# Altium schematic sheet schematic.SchDoc
size A4
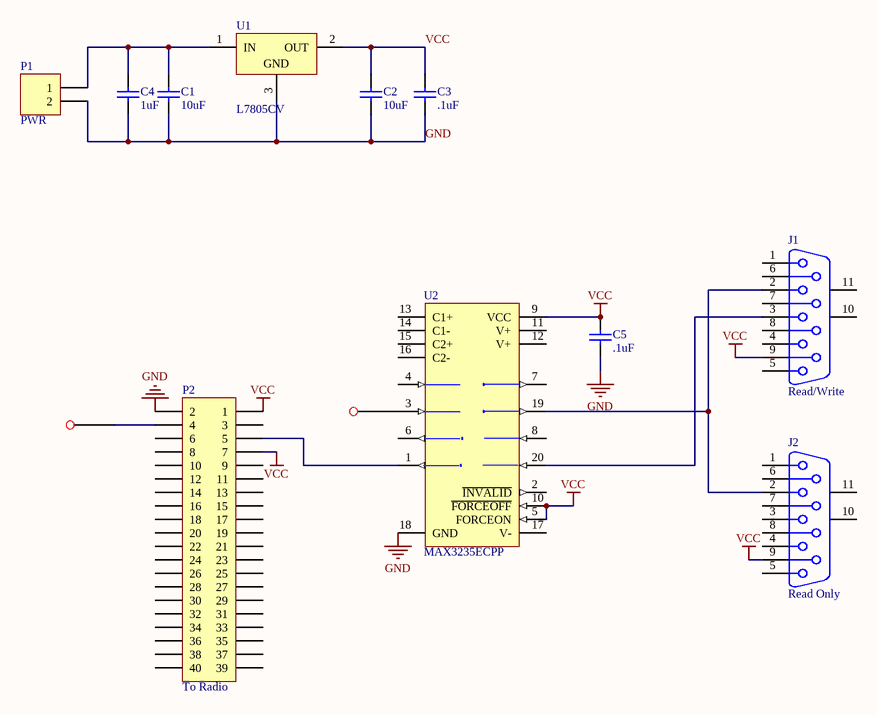
[diagram p0: schematic.SchDoc]

## Parts
C1  10uF  [1206]
C2  10uF  [1206]
C3  .1uF  [1206]
C4  1uF  [1206]
C5  .1uF  [1206]
J1  Read/Write  [DE-9]
J2  Read Only  [DE-9]
P1  PWR  [Screw Terminal - 2]
P2  To Radio  [Header 2x20 2mm r&c pitch]
P3  (no value)  [Solder Pad]
P4  (no value)  [Solder Pad]
U1  L7805CV  [TO220ABN]
U2  MAX3235ECPP  [PP20]

## Nets
GND: C1.1 C2.1 C3.1 C4.1 C5.1 P1.2 P2.2 U1.3(GND) U2.18(GND)
VCC: C2.2 C3.2 C5.2 J1.9 J2.9 P2.1 P2.7 U1.2(OUT) U2.5(FORCEON) U2.9(VCC) U2.10(~{FORCEOFF})
NetC1_2: C1.2 C4.2 P1.1 U1.1(IN)
NetJ1_2: J1.2 J2.2 U2.19(T2OUT)
NetJ1_3: J1.3 U2.20(R2IN)
NetP2_4: P2.4 P3.1
NetP2_5: P2.5 U2.1(R2OUT)
NetP4_1: P4.1 U2.3(T2IN)

Not connected (* = marked no-connect by the designer): J1 1 4 5 6 7 8 10(MH1) 11(MH2); J2 1 3 4 5 6 7 8 10(MH1) 11(MH2); P2 3 6 8 9 10 11 12 13 14 15 16 17 18 19 20 21 22 23 24 25 26 27 28 29 30 31 32 33 34 35 36 37 38 39 40; U2 2(~{INVALID}) 4(T1IN) 6(R1OUT) 7(T1OUT) 8(R1IN) 11(V+) 12(V+) 13(C1+) 14(C1-) 15(C2+) 16(C2-) 17(V-)

## Library data of the parts
C1-C5 = Cap: Capacitor; Published: 8-Jun-2000; LatestRevisionDate: 17-Jul-2002; LatestRevisionNote: Re-released for DXP Platform.; PackageReference: RAD-0.3; Publisher: Altium Limited
  C1 C2: Value: 10uF
  C3 C5: Value: .1uF
  C4: Value: 1uF
J1 J2 = D Connector 9: Receptacle Assembly, 9 Position, Right Angle; PackageDocument: O; Positions: 9; Published: 15-Jun-2001; LatestRevisionDate: 17-Jul-2002; LatestRevisionNote: Re-released for DXP Platform.; DatasheetDocument: 1-Sep-1999; PackageReference: 788750; Publisher: Altium Limited; Orientation: Right Angle; Gender: Receptacle
P1 = Header 2: Header, 2-Pin; LatestRevisionDate: 17-Jul-2002; LatestRevisionNote: Re-released for DXP Platform.; Publisher: Altium Limited
P2 = Header 20X2: Header, 20-Pin, Dual row; LatestRevisionDate: 17-Jul-2002; LatestRevisionNote: Re-released for DXP Platform.; Publisher: Altium Limited
P3 P4 = Solder Pad: A pad to solder a wire connection to
U1 = L7805CV: Positive Voltage Regulator; Note: Tab is connected to pin 3 (GND).; Published: 24-Aug-2001; LatestRevisionDate: 17-Jul-2002; LatestRevisionNote: Re-released for DXP Platform.; DatasheetVersion: Dec-1998; PackageVersion: Jun-1998; PackageReference: TO220ABN; Publisher: Altium Limited; PackageDescription: TO, Thru-Hole, Vertical, Heatsink Mounted; 3 In-Line Leads; Pitch 2.54 mm; Pin sequence 1, 3, 2; ComponentLink1Description: Manufacturer Link; ComponentLink1URL: http://www.st.com/
U2 = MAX3235ECPP: ±15kV ESD-Protected, 1µA, 250kbps, 5V, Dual RS-232 Transceiver with Internal Capacitor; Published: 16-Jan-2001; LatestRevisionDate: 29-May-2009; LatestRevisionNote: Component Body Added.; DatasheetVersion: Apr-1999; PackageVersion: RevB, 21-0043; PackageReference: PP20; Publisher: Altium Limited; PackageDescription: DIP, 20-Pin, Row Spacing 7.62 mm, Pitch 2.54 mm; Code_JEDEC: MS-001-AE; ComponentLink1Description: Manufacturer Link; ComponentLink1URL: http://www.maxim-ic.com/; ComponentLink2Description: Datasheet; ComponentLink2URL: http://pdfserv.maxim-ic.com/en/ds/MAX3233E-MAX3235E.pdf